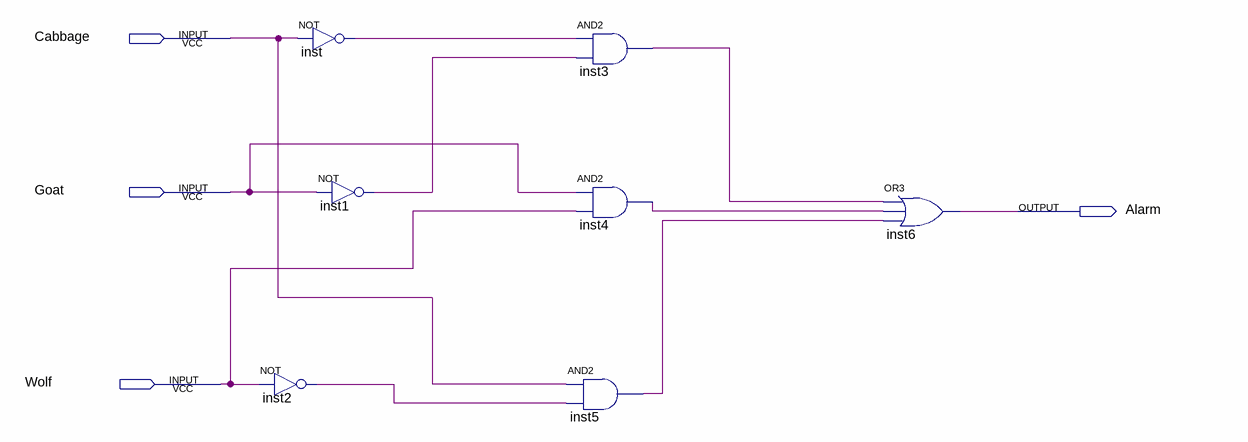
[diagram p0: schematic sheet]
// Quartus schematic lab2step2.bdf as structural Verilog: 7 symbols, 4 pins
module lab2step2 (
  input  Cabbage,
  input  Goat,
  input  Wolf,
  output Alarm
);

  wire inst1_out, inst2_out, inst3_out, inst4_out, inst5_out, inst_out;

  not inst2 (inst2_out, Wolf);
  not inst (inst_out, Cabbage);
  not inst1 (inst1_out, Goat);
  and inst3 (inst3_out, inst_out, inst1_out);
  and inst4 (inst4_out, Goat, Wolf);
  and inst5 (inst5_out, Cabbage, inst2_out);
  or inst6 (Alarm, inst3_out, inst4_out, inst5_out);
endmodule
